# EAGLE design ams (EAGLE 9.5.2)
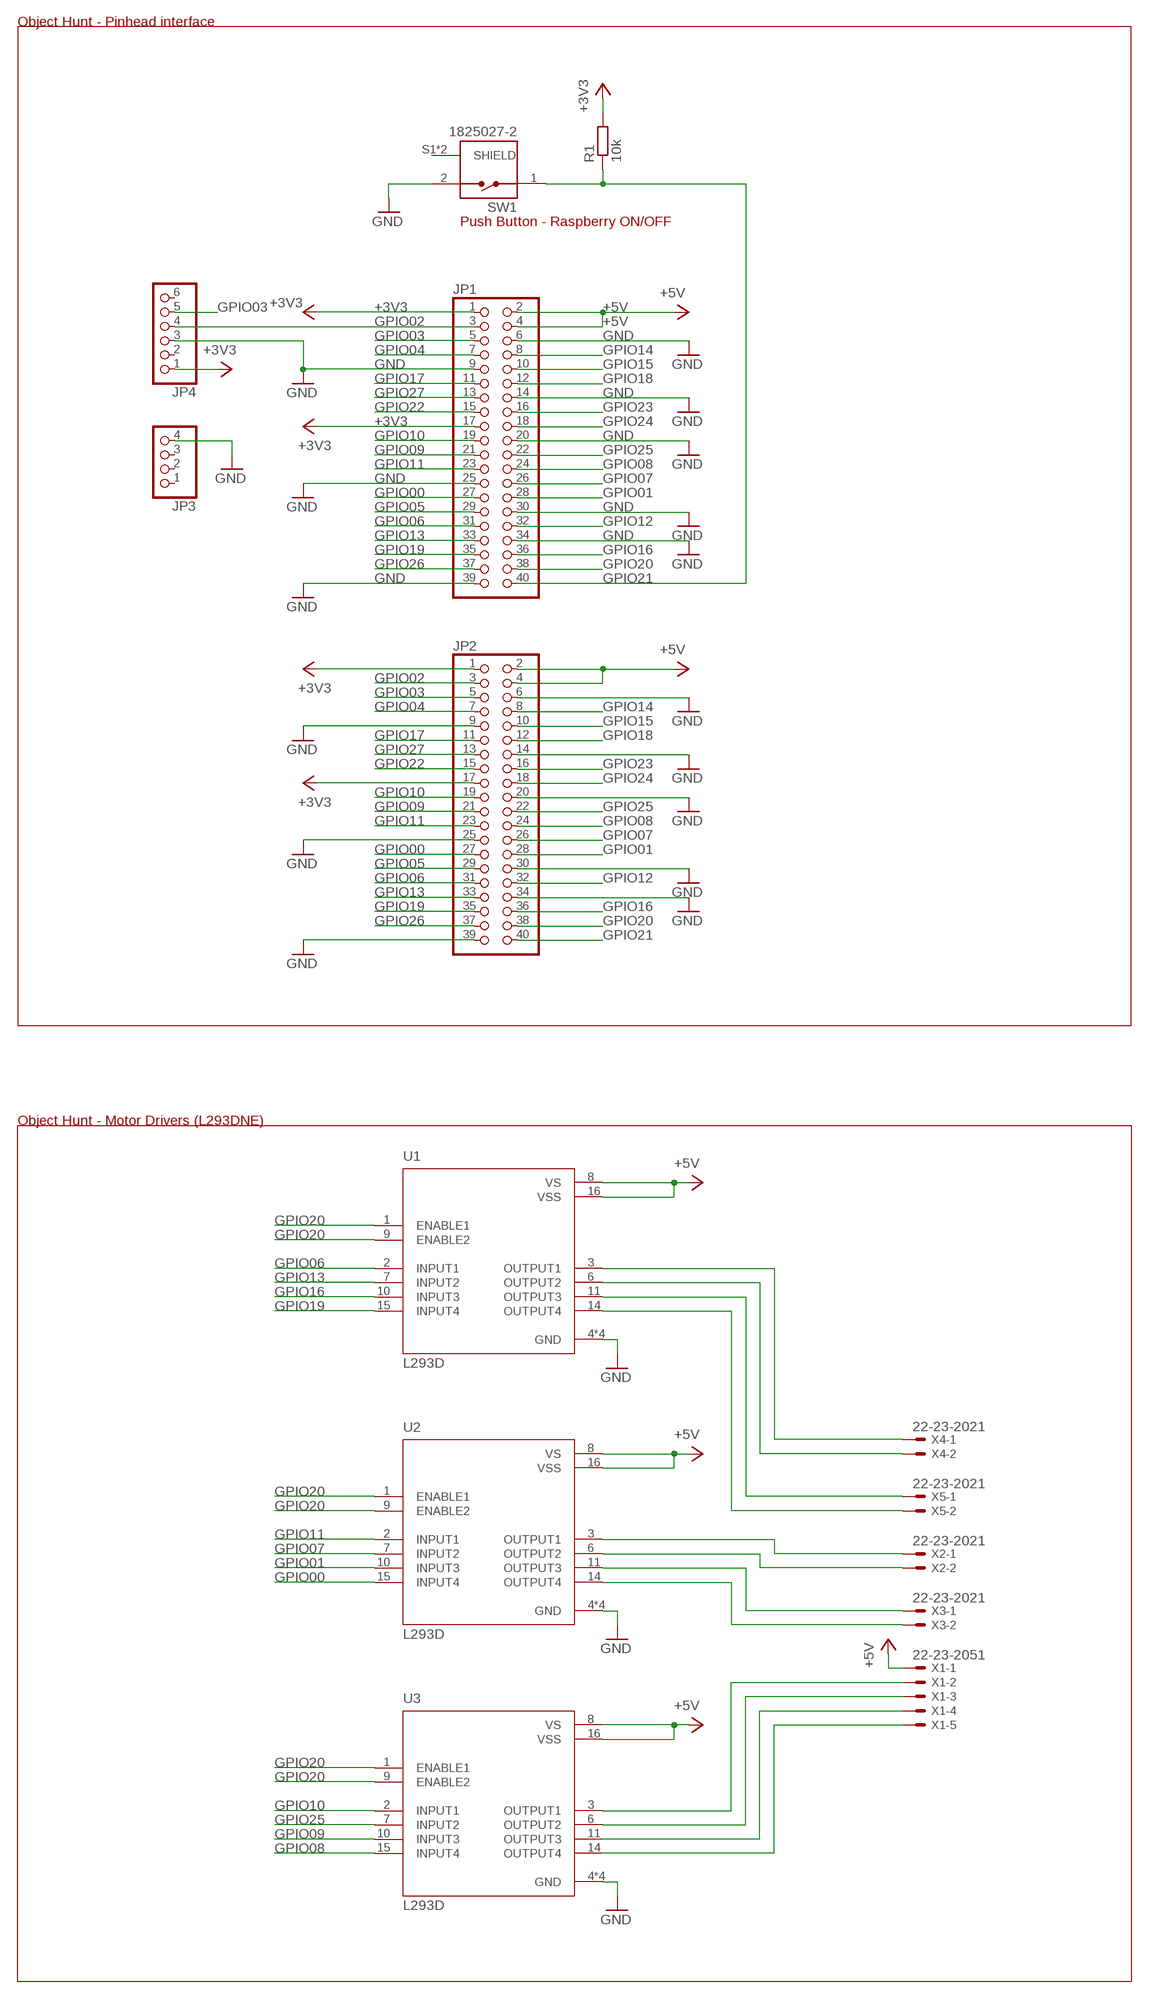
[diagram p0: schematic, sheet 1, part 1 of 2]
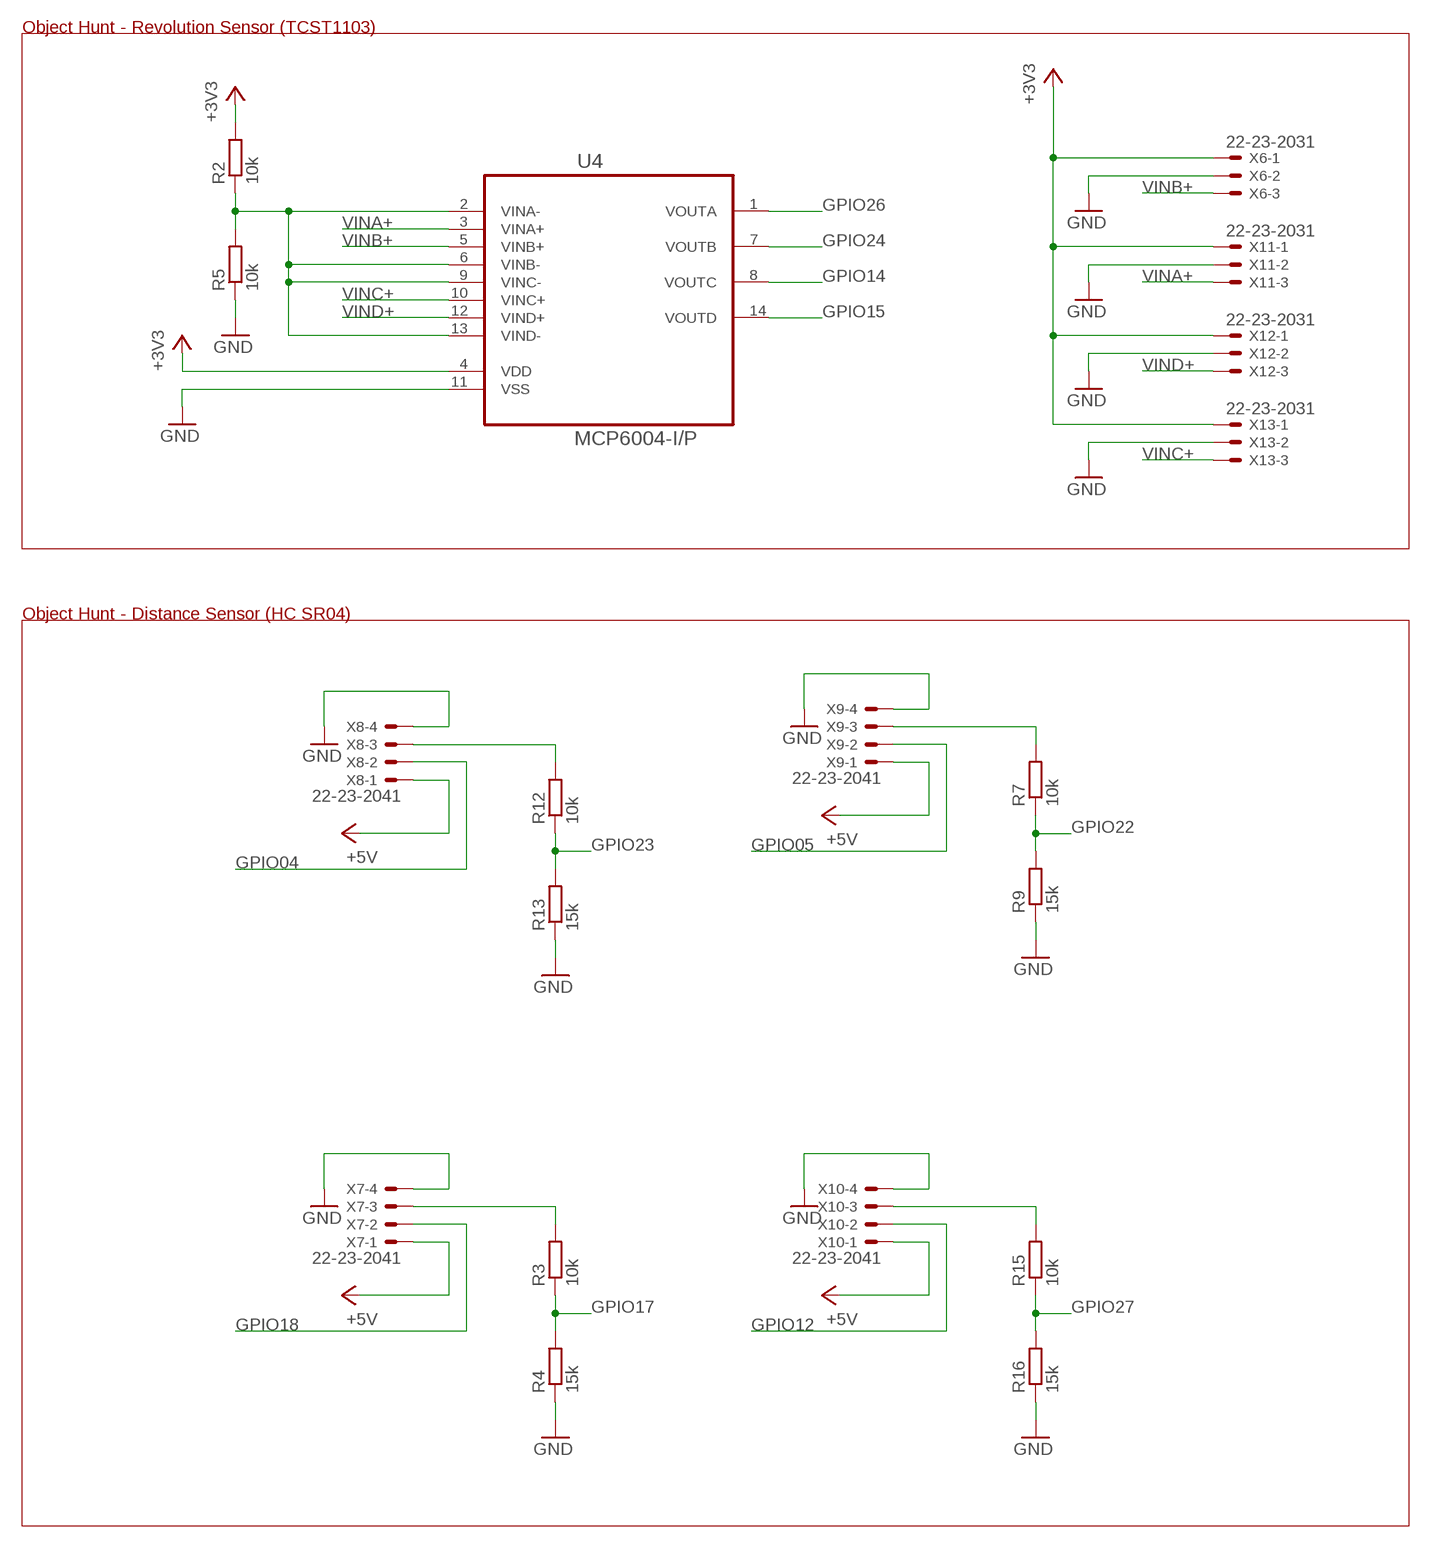
[diagram p1: schematic, sheet 1, part 2 of 2]

## Parts
JP1  PINHD-2X20  [2X20]
JP2  PINHD-2X20  [2X20]
JP3  PINHD-1X4  [1X04]
JP4  PINHD-1X6  [1X06]
R1  10k  R-EU_0204/7  [0204/7]
R2  10k  R-EU_0204/7  [0204/7]
R3  10k  R-EU_0204/7  [0204/7]
R4  15k  R-EU_0204/7  [0204/7]
R5  10k  R-EU_0204/7  [0204/7]
R7  10k  R-EU_0204/7  [0204/7]
R9  15k  R-EU_0204/7  [0204/7]
R12  10k  R-EU_0204/7  [0204/7]
R13  15k  R-EU_0204/7  [0204/7]
R15  10k  R-EU_0204/7  [0204/7]
R16  15k  R-EU_0204/7  [0204/7]
SW1  1825027-2  [TE_1825027-2]
U1  L293D  [DIP880W50P254L2000H510Q16]
U2  L293D  [DIP880W50P254L2000H510Q16]
U3  L293D  [DIP880W50P254L2000H510Q16]
U4  MCP6004-I/P  [DIP254P762X533-14]
X1  22-23-2051  [22-23-2051]
X2  22-23-2021  [22-23-2021]
X3  22-23-2021  [22-23-2021]
X4  22-23-2021  [22-23-2021]
X5  22-23-2021  [22-23-2021]
X6  22-23-2031  [22-23-2031]
X7  22-23-2041  [22-23-2041]
X8  22-23-2041  [22-23-2041]
X9  22-23-2041  [22-23-2041]
X10  22-23-2041  [22-23-2041]
X11  22-23-2031  [22-23-2031]
X12  22-23-2031  [22-23-2031]
X13  22-23-2031  [22-23-2031]

## Nets
+3V3: JP1.1 JP1.17 JP2.1 JP2.17 JP4.1 R1.2 R2.2 U4.4(VDD) X6.1 X11.1 X12.1 X13.1
+5V: JP1.2 JP1.4 JP2.2 JP2.4 U1.8(VS) U1.16(VSS) U2.8(VS) U2.16(VSS) U3.8(VS) U3.16(VSS) X1.1 X7.1 X8.1 X9.1 X10.1
GND: JP1.6 JP1.9 JP1.14 JP1.20 JP1.25 JP1.30 JP1.34 JP1.39 JP2.6 JP2.9 JP2.14 JP2.20 JP2.25 JP2.30 JP2.34 JP2.39 JP3.4 JP4.3 R4.1 R5.1 R9.1 R13.1 R16.1 SW1.2 U1.4(GND) U1.5(GND) U1.12(GND) U1.13(GND) U2.4(GND) U2.5(GND) U2.12(GND) U2.13(GND) U3.4(GND) U3.5(GND) U3.12(GND) U3.13(GND) U4.11(VSS) X6.2 X7.4 X8.4 X9.4 X10.4 X11.2 X12.2 X13.2
GPIO00: JP1.27 JP2.27 U2.15(INPUT4)
GPIO01: JP1.28 JP2.28 U2.10(INPUT3)
GPIO02: JP1.3 JP2.3 JP4.4
GPIO03: JP1.5 JP2.5 JP4.5
GPIO04: JP1.7 JP2.7 X8.2
GPIO05: JP1.29 JP2.29 X9.2
GPIO06: JP1.31 JP2.31 U1.2(INPUT1)
GPIO07: JP1.26 JP2.26 U2.7(INPUT2)
GPIO08: JP1.24 JP2.24 U3.15(INPUT4)
GPIO09: JP1.21 JP2.21 U3.10(INPUT3)
GPIO10: JP1.19 JP2.19 U3.2(INPUT1)
GPIO11: JP1.23 JP2.23 U2.2(INPUT1)
GPIO12: JP1.32 JP2.32 X10.2
GPIO13: JP1.33 JP2.33 U1.7(INPUT2)
GPIO14: JP1.8 JP2.8 U4.8(VOUTC)
GPIO15: JP1.10 JP2.10 U4.14(VOUTD)
GPIO16: JP1.36 JP2.36 U1.10(INPUT3)
GPIO17: JP1.11 JP2.11 R3.1 R4.2
GPIO18: JP1.12 JP2.12 X7.2
GPIO19: JP1.35 JP2.35 U1.15(INPUT4)
GPIO20: JP1.38 JP2.38 U1.1(ENABLE1) U1.9(ENABLE2) U2.1(ENABLE1) U2.9(ENABLE2) U3.1(ENABLE1) U3.9(ENABLE2)
GPIO21: JP1.40 JP2.40 R1.1 SW1.1
GPIO22: JP1.15 JP2.15 R7.1 R9.2
GPIO23: JP1.16 JP2.16 R12.1 R13.2
GPIO24: JP1.18 JP2.18 U4.7(VOUTB)
GPIO25: JP1.22 JP2.22 U3.7(INPUT2)
GPIO26: JP1.37 JP2.37 U4.1(VOUTA)
GPIO27: JP1.13 JP2.13 R15.1 R16.2
N$3: R3.2 X7.3
N$5: R2.1 R5.2 U4.2(VINA-) U4.6(VINB-) U4.9(VINC-) U4.13(VIND-)
N$6: R7.2 X9.3
N$9: R15.2 X10.3
N$25: U1.3(OUTPUT1) X4.1
N$26: U1.6(OUTPUT2) X4.2
N$27: U1.11(OUTPUT3) X5.1
N$28: U1.14(OUTPUT4) X5.2
N$31: U2.3(OUTPUT1) X2.1
N$32: U2.6(OUTPUT2) X2.2
N$33: U2.11(OUTPUT3) X3.1
N$34: U2.14(OUTPUT4) X3.2
N$39: U3.3(OUTPUT1) X1.2
N$40: U3.6(OUTPUT2) X1.3
N$41: U3.11(OUTPUT3) X1.4
N$42: U3.14(OUTPUT4) X1.5
N$47: R12.2 X8.3
VINA+: U4.3(VINA+) X11.3
VINB+: U4.5(VINB+) X6.3
VINC+: U4.10(VINC+) X13.3
VIND+: U4.12(VIND+) X12.3
Unconnected: JP3.1 JP3.2 JP3.3 JP4.2 JP4.6 SW1.S1(SHIELD) SW1.S2(SHIELD)

## Notes on the sheet
- Object Hunt - Pinhead interface
- Push Button - Raspberry ON/OFF
- Object Hunt - Motor Drivers (L293DNE)
- Object Hunt - Revolution Sensor (TCST1103)
- Object Hunt - Distance Sensor (HC SR04)

## Library data of the parts
JP1 JP2 = pinhead:PINHD-2X20: PIN HEADER
JP3 = pinhead:PINHD-1X4: PIN HEADER
JP4 = pinhead:PINHD-1X6: PIN HEADER
R1-R5 R7 R9 R12 R13 R15 R16 = rcl:R-EU_: RESISTOR, European symbol; SPICEPREFIX: R
SW1 = 1825027-2:1825027-2: Switch Tactile OFF (ON) SPST Round Button PC Pins 0.05A 24VDC 1.57N Thru-Hole Loose Piece; AVAILABILITY: Unavailable; COMMENT: 1825027-2; DESCRIPTION: Switch Tactile OFF _ON_ SPST Round Button PC Pins 0.05A 24VDC 1.57N Thru-Hole Loose Piece; EU_ROHS_COMPLIANCE: Compliant; MF: TE Connectivity; MP: 1825027-2; PACKAGE: None; PRICE: None; TE_PURCHASE_URL: https://www.te.com/usa-en/product-1825027-2.html?te_bu=Cor&te_type=disp&te_campaign=seda_glo_cor-seda-global-disp-prtnr-fy19-seda-model-bom-cta_sma-317_1&elqCampaignId=32493
U1-U3 = L293D:L293D: 4-Channel Motor Driver 24V 16-Pin Power PDIP Tube; AVAILABILITY: Unavailable; DESCRIPTION: 4-Channel Motor Driver 24V 16-Pin Power PDIP Tube; MF: STMicroelectronics; MP: L293D; PACKAGE: DIP-16 STMicroelectronics; PRICE: None
U4 = Microchip_By_element14_Batch_1:MCP6004-I/P: IC OPAMP QUAD 1.8V; MPN: MCP6004-I/P; OC_FARNELL: 1605571; OC_NEWARK: 61K2951; PACKAGE: 14DIP; SUPPLIER: Microchip
X1 = con-molex:22-23-2051: .100" (2.54mm) Center Header - 5 Pin; MF: MOLEX; MPN: 22-23-2051; OC_FARNELL: 1462952; OC_NEWARK: 38C9178
X2-X5 = con-molex:22-23-2021: .100" (2.54mm) Center Header - 2 Pin; MF: MOLEX; MPN: 22-23-2021; OC_FARNELL: 1462926; OC_NEWARK: 25C3832
X6 X11-X13 = con-molex:22-23-2031: .100" (2.54mm) Center Header - 3 Pin; MF: MOLEX; MPN: 22-23-2031; OC_FARNELL: 1462950; OC_NEWARK: 30C0862
X7-X10 = con-molex:22-23-2041: .100" (2.54mm) Center Header - 4 Pin; MF: MOLEX; MPN: 22-23-2041; OC_FARNELL: 1462920; OC_NEWARK: 38C0355

## Board
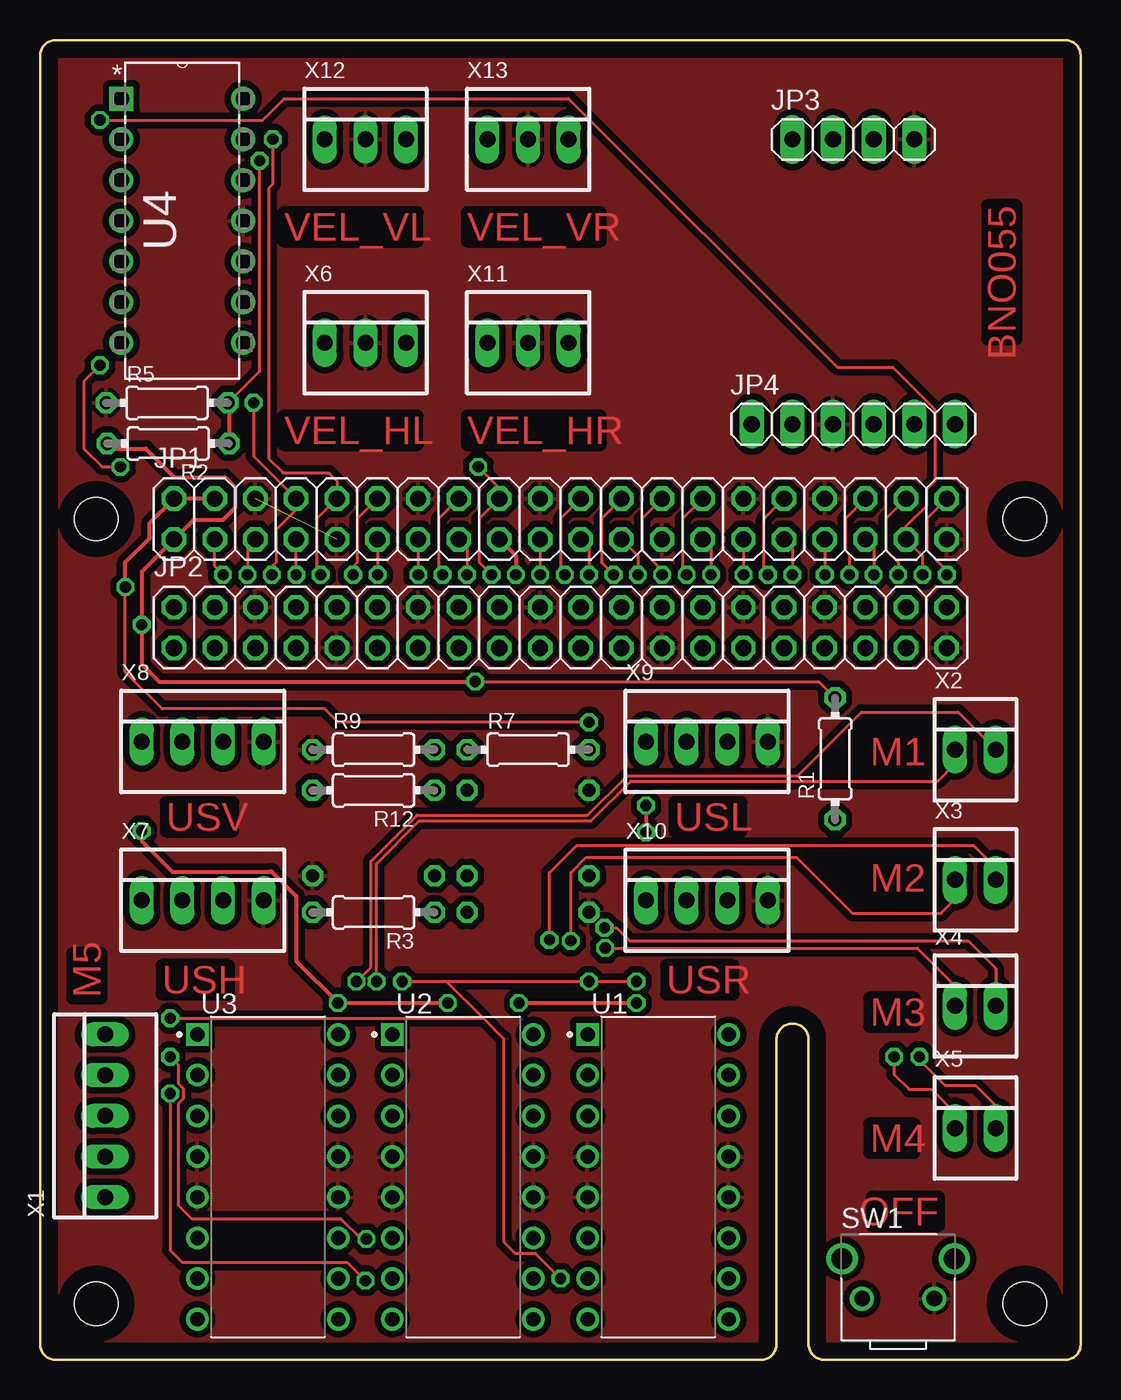
[diagram p2: board, top side]
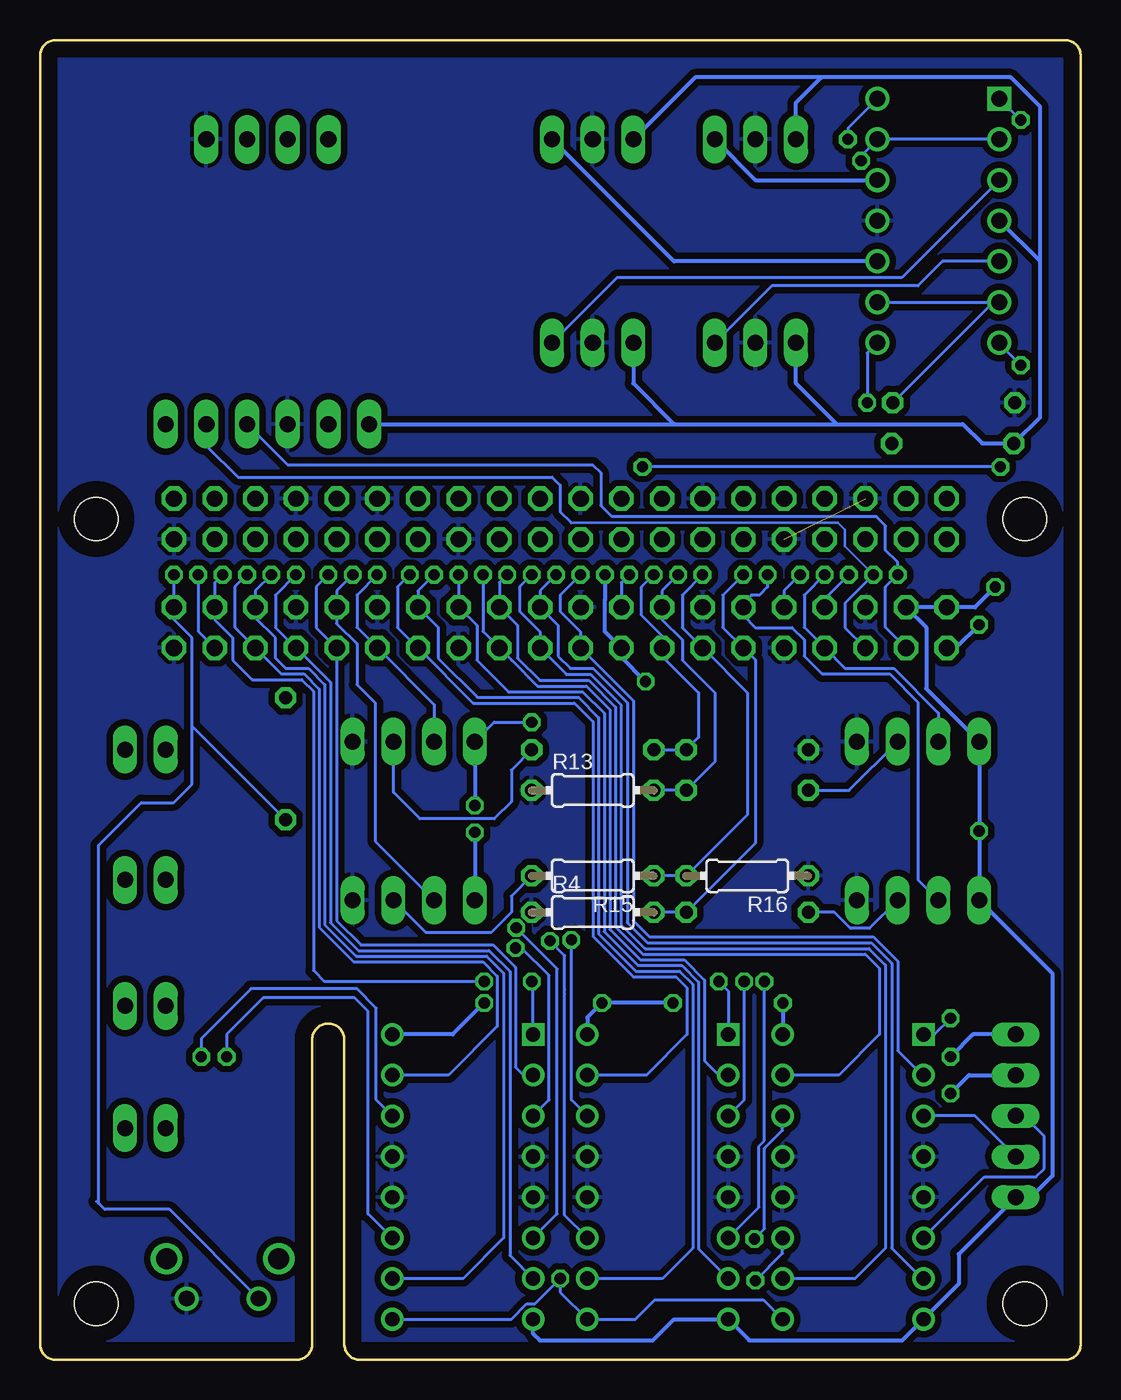
[diagram p3: board, bottom side, seen from below]

Size 65 x 82.4 mm. Coordinates in mm from the lower left corner, seen from the top.
Outline: 1,0 45,0 arc90 46,1 46,20 arc-90 47,21 arc-90 48,20 48,1 arc90 49,0 64,0 arc90 65,1 65,81.4 arc90 64,82.4 1,82.4 arc90 0,81.4 0,1 arc90 1,0
Copper layers (1*16): Top 0.035mm / dielectric 1.5mm / Bottom 0.035mm
Design rules "default": minimum track width 6mil, minimum drill 0.35mm, track to track 6mil, track to pad 6mil, pad to pad 6mil, via to via 6mil, smd to smd 6mil, copper to edge 40mil, drill to drill 6mil, minimum pad ring 10mil, minimum via ring 8mil, stop-mask expansion 4mil, vias tented up to drill 0mil, thermal gap 10mil
Holes 2.7 mm at 3.5,52.5 61.5,52.5 3.5,3.5 61.5,3.5

### Footprints (pad centres in the part's own frame; a part is rotated, then mirrored left to right if it is on the bottom)
2X20 = drill 1.016 octagon: 1 -24.13,-1.27; 2 -24.13,1.27; 3 -21.59,-1.27; 4 -21.59,1.27; 5 -19.05,-1.27; 6 -19.05,1.27; 7 -16.51,-1.27; 8 -16.51,1.27; 9 -13.97,-1.27; 10 -13.97,1.27; 11 -11.43,-1.27; 12 -11.43,1.27; 13 -8.89,-1.27; 14 -8.89,1.27; 15 -6.35,-1.27; 16 -6.35,1.27; 17 -3.81,-1.27; 18 -3.81,1.27; 19 -1.27,-1.27; 20 -1.27,1.27; 21 1.27,-1.27; 22 1.27,1.27; 23 3.81,-1.27; 24 3.81,1.27; 25 6.35,-1.27; 26 6.35,1.27; 27 8.89,-1.27; 28 8.89,1.27; 29 11.43,-1.27; 30 11.43,1.27; 31 13.97,-1.27; 32 13.97,1.27; 33 16.51,-1.27; 34 16.51,1.27; 35 19.05,-1.27; 36 19.05,1.27; 37 21.59,-1.27; 38 21.59,1.27; 39 24.13,-1.27; 40 24.13,1.27
1X04 = drill 1.016 long: 1 -3.81,0; 2 -1.27,0; 3 1.27,0; 4 3.81,0
1X06 = drill 1.016 long: 1 -6.35,0; 2 -3.81,0; 3 -1.27,0; 4 1.27,0; 5 3.81,0; 6 6.35,0
0204/7 = drill 0.813 octagon: 1 -3.81,0; 2 3.81,0
TE_1825027-2 = drill 0.99: 1 -2.25,-1.245; 2 2.25,-1.245 | drill 1.3: S1 -3.505,1.245; S2 3.505,1.245
DIP880W50P254L2000H510Q16 = drill 0.9 pad 1.25 square: 1 -4.4,8.89 | drill 0.9 pad 1.25: 2 -4.4,6.35; 3 -4.4,3.81; 4 -4.4,1.27; 5 -4.4,-1.27; 6 -4.4,-3.81; 7 -4.4,-6.35; 8 -4.4,-8.89; 9 4.4,-8.89; 10 4.4,-6.35; 11 4.4,-3.81; 12 4.4,-1.27; 13 4.4,1.27; 14 4.4,3.81; 15 4.4,6.35; 16 4.4,8.89
DIP254P762X533-14 = drill 0.991 square: 1 -7.62,15.24 | drill 0.991: 2 -7.62,12.7; 3 -7.62,10.16; 4 -7.62,7.62; 5 -7.62,5.08; 6 -7.62,2.54; 7 -7.62,0; 8 0,0; 9 0,2.54; 10 0,5.08; 11 0,7.62; 12 0,10.16; 13 0,12.7; 14 0,15.24
22-23-2051 = drill 1 long: 1 -5.08,0; 2 -2.54,0; 3 0,0; 4 2.54,0; 5 5.08,0
22-23-2021 = drill 1 long: 1 -1.27,0; 2 1.27,0
22-23-2031 = drill 1 long: 1 -2.54,0; 2 0,0; 3 2.54,0
22-23-2041 = drill 1 long: 1 -3.81,0; 2 -1.27,0; 3 1.27,0; 4 3.81,0

### Placement (x,y rotation side)
JP1  32.5,52.5 0 top
JP2  32.5,45.72 0 top
JP3  50.8,76.2 0 top
JP4  50.8,58.42 0 top
R1  49.66,37.53 90 top
R2  8,57.21 180 top
R3  20.83,27.94 180 top
R4  30.48,27.94 0 bottom
R5  7.94,59.75 0 top
R7  30.48,38.1 0 top
R9  20.83,38.1 0 top
R12  20.83,35.56 180 top
R13  30.48,35.56 0 bottom
R15  30.48,30.23 180 bottom
R16  20.83,30.23 180 bottom
SW1  53.59,5.08 0 top
U1  38.61,11.43 0 top
U2  26.42,11.43 0 top
U3  14.22,11.43 0 top
U4  12.7,63.5 0 top
X1  4.06,15.24 90 top
X2  58.42,38.1 0 top
X3  58.42,29.97 0 top
X4  58.42,22.1 0 top
X5  58.42,14.48 0 top
X6  20.32,63.5 0 top
X7  10.16,28.7 0 top
X8  10.16,38.61 0 top
X9  41.66,38.61 0 top
X10  41.66,28.7 0 top
X11  30.48,63.5 0 top
X12  20.32,76.2 0 top
X13  30.48,76.2 0 top

### Tracks (layer width: path | path; a pad name or v marks a point on that pad's centre or on a via)
+3V3  (via drill 0.7)
  Top 0.2: v27.18,42.35 48.64,42.35 R1.2
  Top 0.254: JP1.17 29.72,50.2 v29.72,49.02 | v27.18,42.35 7.43,42.35 6.35,43.43 v6.35,45.9 6.35,49.21 JP1.1 9.59,52.45 11.43,52.45 12.19,53.21 12.19,54.48 11.56,55.12 8.38,55.12 6.6,56.9 4.51,56.9 R2.2
  Bottom 0.254: v6.35,45.9 7.8,44.45 JP2.1 | v29.72,49.02 29.72,47.44 29.73,47.42 29.73,45.49 JP2.17 28.69,43.87 v27.18,42.35 | 2.54,68.58 U4.4 | 15.24,58.42 17.78,60.96 X6.1 | X11.1 27.94,60.96 25.4,58.42 | 25.4,58.42 15.24,58.42 | X13.1 24.07,80.07 16.19,80.07 | X12.1 17.78,78.49 16.19,80.07 | 2.54,68.58 2.54,58.86 R2.2 6.16,57.21 7.37,58.42 15.24,58.42 | 2.54,68.58 2.54,78.23 4.38,80.07 16.19,80.07 | JP4.1 25.4,58.42
+5V  (via drill 0.7)
  Top 0.2: v34.29,39.81 18.61,39.81 17.78,40.64 7.62,40.64 5.33,42.93 v5.33,48.26
  Top 0.254: JP1.4 JP1.2 6.86,52.26 6.86,51.31 5.33,49.78 v5.33,48.26 | v6.35,33.02 6.35,32.38 8.25,30.49 14.4,30.49 14.41,30.48 14.48,30.48 16,28.96 16,24.89 v18.61,22.29 v25.46,22.29 | v29.91,22.29 v37.26,22.29 | v37.85,34.61 v37.85,32.94
  Bottom 0.2: X9.1 36.64,39.81 v34.29,39.81
  Bottom 0.254: v5.33,48.26 6.6,46.99 JP2.2 JP2.4 9.65,45.73 9.65,41.91 X8.1 v6.35,33.02 X7.1 1.78,24.13 1.78,11.49 3.11,10.16 X1.1 7.62,6.6 7.62,4.74 U3.8 11.14,1.22 20.7,1.22 U2.8 25.4,2.54 26.72,1.22 33.78,1.22 34.21,1.65 U1.8 | U2.16 30.82,21.38 v29.91,22.29 v25.46,22.29 | v18.61,22.29 18.61,20.34 U3.16 | v37.26,22.29 39.22,20.32 U1.16 | X9.1 v37.85,34.61 | v37.85,32.94 X10.1
GND  (1 unrouted)
  pour Bottom (isolate 0.406): 0,81.42 0,1 arc90 1,0 45,0 arc90 46,1 46,20 arc-90 47,21 arc-90 48,20 48,1 arc90 49,0 64,0 arc90 65,1 65,81.42 arc90 64.02,82.4 0.98,82.4 arc90
  pour Top (isolate 0.406): 0,81.42 0,1 arc90 1,0 45,0 arc90 46,1 46,20 arc-90 47,21 arc-90 48,20 48,1 arc90 49,0 64,0 arc90 65,1 65,81.42 arc90 64.02,82.4 0.98,82.4 arc90
GPIO00  (via drill 0.7)
  Top 0.2: JP1.27 41.91,50.71 v41.91,49.02
  Bottom 0.2: 41.91,44.97 41.9,44.96 | 41.9,44.96 JP2.27 37.95,41.01 31.62,41.01 30.46,39.85 30.46,26.45 27.94,23.92 25.27,23.92 24.58,23.23 24.58,20.32 27.12,17.78 U2.15 | v41.91,49.02 42.67,48.26 42.67,45.72 41.92,44.96 41.9,44.96
GPIO01  (via drill 0.7)
  Top 0.2: JP1.28 40.13,52.51 40.13,49.28 v40.39,49.02
  Bottom 0.2: U2.10 26.13,5.08 24.23,6.99 24.23,23.44 25.06,24.27 27.79,24.27 30.11,26.59 30.11,40.1 31.37,41.36 37.68,41.36 40.13,43.81 40.13,45.73 JP2.28 41.39,48.02 v40.39,49.02
GPIO02  (via drill 0.7)
  Top 0.2: v11.43,49.02 10.91,49.54 JP1.3
  Bottom 0.2: JP4.4 49.53,55.88 30.48,55.88 29.97,55.37 29.97,53.34 29.27,52.64 12.76,52.64 12.19,52.07 12.19,50.55 11.43,49.78 v11.43,49.02 12.19,48.26 12.19,45.73 JP2.3
GPIO03  (via drill 0.7)
  Top 0.2: JP1.5 12.95,50.73 v12.95,49.02
  Bottom 0.152: v12.95,49.02 14.73,50.8 14.73,51.31 14.73,51.82 15.18,52.26 31.81,52.26
  Bottom 0.2: JP4.5 54.61,57.09 52.64,55.12 33.02,55.12 32.51,54.61 32.51,52.96 31.81,52.26 | v12.95,49.02 14.73,47.24 14.73,45.72 13.46,44.45 JP2.5
GPIO04  (via drill 0.7)
  Top 0.2: v16,49.02 16,51.22 JP1.7
  Bottom 0.2: X8.2 8.89,40.39 11.68,43.18 14.72,43.18 JP2.7 17.27,45.73 17.27,47.75 v16,49.02
GPIO05  (via drill 0.7)
  Top 0.2: JP1.29 43.94,51.22 v43.94,49.02
  Bottom 0.2: X9.2 40.39,40.91 JP2.29 45.21,45.73 45.21,47.75 v43.94,49.02
GPIO06  (via drill 0.7)
  Top 0.2: JP1.31 46.99,50.71 v46.99,49.02
  Bottom 0.2: U1.2 34.8,17.78 35.31,18.29 35.31,24.51 36.7,25.91 44.96,25.91 46.47,27.42 46.47,39.78 JP2.31 46.99,44.97 47,44.97 47.75,45.72 47.75,48.26 v46.99,49.02
GPIO07  (via drill 0.7)
  Top 0.2: JP1.26 37.59,52.51 37.59,50.55 38.86,49.28 v38.86,49.02
  Bottom 0.2: U2.7 23.88,6.94 23.88,23.59 24.91,24.62 27.64,24.62 29.76,26.74 29.76,40.36 31.11,41.71 35.74,41.71 37.72,43.69 37.72,45.86 JP2.26 v38.85,49.01 v38.86,49.02
GPIO08  (via drill 0.7)
  Top 0.2: JP1.24 35.05,52.51 35.05,49.78 v35.81,49.02
  Bottom 0.2: U3.15 15.11,17.78 12.57,20.32 12.57,24.44 13.46,25.33 27.35,25.33 29.05,27.03 29.05,40.75 30.72,42.42 33.78,42.42 35.18,43.81 35.18,45.86 JP2.24 36.31,48.53 v35.81,49.02
GPIO09  (via drill 0.7)
  Top 0.2: JP1.21 34.29,50.71 v34.29,49.02
  Bottom 0.2: U3.10 14.1,5.08 12.19,6.99 12.19,24.65 13.23,25.68 27.21,25.68 28.7,27.18 28.7,40.89 30.61,42.8 32.12,42.8 JP2.21 33.77,45.45 35.05,46.74 35.05,48.26 v34.29,49.02
GPIO10  (via drill 0.7)
  Top 0.2: JP1.19 31.24,51.22 v31.24,49.02
  Bottom 0.2: U3.2 9.91,17.78 11.43,19.3 11.43,24.89 12.95,26.42 26.92,26.42 27.94,27.43 27.94,41.16 JP2.19 31.23,45.45 32.51,46.74 32.51,47.75 v31.24,49.02
GPIO11  (via drill 0.7)
  Top 0.2: JP1.23 37.34,50.2 v37.34,49.02
  Bottom 0.2: v37.34,49.02 37.34,45.48 JP2.23 35.53,43.67 33.93,42.07 30.87,42.07 29.41,40.6 29.41,26.89 27.5,24.98 24.77,24.98 23.5,23.71 23.5,18.67 22.61,17.78 U2.2
GPIO12  (via drill 0.7)
  Top 0.2: JP1.32 45.21,52.51 45.21,49.28 v45.47,49.02
  Bottom 0.2: X10.2 44.07,32.38 44.07,41.02 45.21,42.16 45.21,44.7 46.48,45.97 46.48,46.98 JP2.32 46.47,48.02 v45.47,49.02
GPIO13  (via drill 0.7)
  Top 0.2: JP1.33 49.02,51.22 v49.02,49.02
  Bottom 0.2: U1.7 35.66,6.53 35.66,24.26 36.96,25.56 45.11,25.56 46.86,27.3 46.86,42.3 JP2.33 49.02,44.46 49.03,44.46 50.29,45.72 50.29,47.75 v49.02,49.02
GPIO14  (via drill 0.7)
  Top 0.2: v13.34,59.75 13.34,56.42 JP1.8 15.99,53.07 14.73,51.82 14.73,49.78 14.48,49.53 v14.48,49.02
  Bottom 0.2: U4.8 13.34,62.87 v13.34,59.75 | v14.48,49.02 15.99,47.51 JP2.8
GPIO15  (via drill 0.7)
  Top 0.2: v14.54,76.2 14.54,73.41 14.29,73.15 14.29,56.26 15.18,55.37 18.03,55.37 18.54,54.86 18.54,53.78 JP1.10 17.27,52.51 17.27,49.28 v17.53,49.02
  Bottom 0.2: U4.14 14.54,76.9 v14.54,76.2 | v17.53,49.02 18.53,48.02 JP2.10
GPIO16  (via drill 0.7)
  Top 0.2: JP1.36 50.29,52.51 50.29,50.55 50.55,50.29 v50.55,49.02
  Bottom 0.2: U1.10 38.58,5.08 36.04,7.62 36.04,24.14 37.1,25.2 45.26,25.2 47.22,27.16 47.22,42.16 48.24,43.18 49.66,43.18 50.29,43.81 50.29,45.09 51.55,46.34 JP2.36 51.55,48.02 v50.55,49.02
GPIO17  (via drill 0.7)
  Top 0.2: JP1.11 21.08,51.22 v21.08,49.02
  Bottom 0.2: R4.2 R3.1 20.32,32.26 20.32,43.7 JP2.11 22.34,45.72 22.35,45.72 22.35,47.75 v21.08,49.02
GPIO18  (via drill 0.7)
  Top 0.2: JP1.12 19.81,52.51 19.81,49.78 19.56,49.53 v19.56,49.02
  Bottom 0.2: X7.2 10.16,29.97 10.16,41.05 11.94,42.83 16.16,42.83 17.27,43.94 17.27,44.96 18.03,45.72 20.32,45.72 21.08,46.48 21.08,46.98 JP2.12 | 21.07,47 JP2.12 | v19.56,49.02 19.56,48.26 20.07,47.75 20.57,47.75 21.07,47.26 JP2.12
GPIO19  (via drill 0.7)
  Top 0.2: JP1.35 52.07,50.71 v52.07,49.02
  Bottom 0.2: U1.15 39.5,17.78 36.45,20.83 36.45,23.96 37.34,24.85 45.41,24.85 47.57,27.01 47.57,41.88 48.51,42.83 49.93,42.83 JP2.35 52.83,45.73 52.83,48.26 v52.07,49.02
GPIO20  (via drill 0.7)
  Top 0.2: JP1.38 52.83,52.51 52.83,50.55 53.59,49.78 v53.59,49.02 | v37.26,23.62 v34.29,23.62 25.4,23.62 | 25.4,23.62 v22.61,23.62 | 27.69,21.34 25.4,23.62 | v32.51,5.08 30.93,6.66 29.66,6.66 28.96,7.37 28.96,20.07 27.69,21.34 | v8.13,21.34 27.69,21.34
  Bottom 0.2: v37.26,23.62 47.22,23.62 47.92,24.33 47.92,41.73 48.66,42.48 51.75,42.48 52.96,43.69 52.96,45.09 54.09,46.22 JP2.38 54.09,48.53 v53.59,49.02 | v22.61,23.62 22.02,23.03 U2.1 | U1.1 34.21,23.54 v34.29,23.62 | U1.9 35.56,2.54 34.6,3.5 34.1,3.5 v32.51,5.08 32.51,4.24 U2.9 27.81,2.54 26.61,3.75 19.83,3.75 U3.9 | U3.1 9.14,20.32 v8.13,21.34
GPIO21  (via drill 0.7)
  Top 0.2: JP1.40 55.37,52.51 55.37,50.55 56.64,49.28 v56.64,49.02
  Bottom 0.2: SW1.1 56.91,9.4 60.96,9.4 61.34,9.78 | 61.34,9.78 61.47,9.91 | R1.1 55.5,39.56 | 55.5,39.56 55.5,45.09 56.63,46.22 JP2.40 56.64,47 v56.64,49.02 | 61.34,9.78 61.34,32.13 58.67,34.8 56.64,34.8 55.5,35.94 55.5,39.56
GPIO22  (via drill 0.7)
  Top 0.2: JP1.15 26.67,50.71 v26.67,49.02
  Bottom 0.2: R7.1 R9.2 23.88,38.86 23.88,41.66 26.15,43.93 JP2.15 26.15,45.2 27.43,46.48 27.43,48.26 v26.67,49.02
GPIO23  (via drill 0.7)
  Top 0.2: JP1.16 24.89,52.51 24.89,49.28 v25.15,49.02
  Bottom 0.2: R13.2 R12.1 22.86,37.34 22.86,41.66 24.89,43.69 24.89,44.96 26.15,46.22 JP2.16 26.15,48.02 v25.15,49.02
GPIO24  (via drill 0.7)
  Top 0.2: v3.75,62.1 2.73,61.09 2.73,56.9 3.87,55.75 v5.02,55.75 | v27.37,55.75 28.69,54.43 JP1.18 27.43,52.51 27.43,49.78 v28.19,49.02
  Bottom 0.2: v28.19,49.02 28.69,48.53 JP2.18 | U4.7 5.08,63.44 v3.75,62.1 | v5.02,55.75 v27.37,55.75
GPIO25  (via drill 0.7)
  Top 0.2: JP1.22 32.51,52.51 32.51,49.28 v32.77,49.02
  Bottom 0.2: U3.7 9.91,5.08 11.81,6.99 11.81,24.77 13.08,26.04 27.05,26.04 28.32,27.3 28.32,41.04 30.46,43.18 31.88,43.18 32.64,43.94 32.64,45.86 JP2.22 33.77,48.02 v32.77,49.02
GPIO26  (via drill 0.7)
  Top 0.2: v55.12,49.02 55.12,50.2 JP1.37 54.09,52.06 55.37,53.34 55.37,54.36 55.88,54.86 55.88,59.35 53.25,61.98 49.78,61.98 33.02,78.74 15.24,78.74 13.91,77.41 v3.75,77.41
  Bottom 0.2: v55.12,49.02 55.12,45.48 JP2.37 | U4.1 v3.75,77.41
GPIO27  (via drill 0.7)
  Top 0.2: JP1.13 23.62,51.22 v23.62,49.02
  Bottom 0.2: R15.1 R16.2 20.83,34.04 20.83,41.67 JP2.13 23.62,44.46 23.63,44.46 24.89,45.72 24.89,47.75 v23.62,49.02
N$3
  Bottom 0.2: R3.2 15.38,27.94 14.39,26.94 13.19,26.94 X7.3
N$5  (via drill 0.7)
  Top 0.2: R5.2 13.72,61.72 v13.72,74.87
  Top 0.254: R2.1 11.81,59.69 R5.2
  Bottom 0.2: U4.9 U4.6 5.46,66.04 R5.2 | U4.2 U4.13 13.72,75.18 v13.72,74.87
N$6
  Bottom 0.2: R7.2 35.56,36.83 35.56,34.86 36.64,33.78 41.27,33.78 42.93,35.43 X9.3
N$9
  Bottom 0.2: R15.2 35.56,28.96 35.56,27.94 36.83,26.67 40.89,26.67 X10.3
N$25  (via drill 0.7)
  Top 0.2: v35.31,25.72 54.8,25.72 57.15,23.37 X4.1
  Bottom 0.2: U1.3 33.21,16.24 33.21,24 34.92,25.72 v35.31,25.72
N$26  (via drill 0.7)
  Top 0.2: v35.26,26.98 36.02,26.98 36.83,26.16 57.98,26.16 59.69,24.45 X4.2
  Bottom 0.2: U1.6 32.7,9.13 32.7,24.42 v35.26,26.98
N$27  (via drill 0.7)
  Top 0.2: v53.34,18.92 53.34,17.84 54.29,16.89 55.69,16.89 57.15,15.43 X5.1
  Bottom 0.2: U1.11 44.51,9.13 44.51,21.78 45.34,22.61 51.05,22.61 53.34,20.32 v53.34,18.92
N$28  (via drill 0.7)
  Top 0.2: v54.93,18.92 54.93,18.73 56.52,17.14 58.42,17.14 59.69,15.88 X5.2
  Bottom 0.2: U1.14 44.01,16.24 44.01,21.97 45.21,23.18 51.82,23.18 54.93,20.07 v54.93,18.92
N$31  (via drill 0.7)
  Top 0.2: v21.02,23.62 21.02,30.99 23.69,33.66 34.42,33.66 36.89,36.13 56.07,36.13 57.15,37.21 X2.1
  Bottom 0.2: U2.3 21.02,16.24 v21.02,23.62
N$32  (via drill 0.7)
  Top 0.2: v19.76,23.62 20.67,24.53 20.67,31.13 23.54,34.01 34.21,34.01 36.68,36.48 47.34,36.48 51.31,40.45 57.34,40.45 X2.2
  Bottom 0.2: U2.6 20.1,9.54 20.1,13.35 19.76,13.7 v19.76,23.62
N$33  (via drill 0.7)
  Top 0.2: v33.15,26.16 33.15,30.42 34.1,31.37 47.24,31.37 50.74,27.88 56.26,27.88 57.15,28.77 X3.1
  Bottom 0.2: U2.11 32.23,9.03 32.23,22.86 32.23,23.11 32.23,25.24 v33.15,26.16
N$34  (via drill 0.7)
  Top 0.2: v31.81,26.23 31.81,30.42 33.53,32.13 58.29,32.13 59.69,30.73 X3.2
  Bottom 0.2: U2.14 31.81,16.24 v31.81,26.23
N$39
  Bottom 0.2: X1.2 6.6,15.24 U3.3
N$40
  Bottom 0.2: U3.6 6.01,11.43 2.79,11.43 2.29,11.94 2.29,13.97 3.56,15.24 X1.3
N$41  (via drill 0.7)
  Top 0.2: v20.32,4.95 19.18,6.1 8.89,6.1 8.13,6.86 v8.13,16.64
  Bottom 0.2: v20.32,4.95 18.62,6.65 U3.11
  Bottom 0.254: v8.13,16.64 6.99,17.78 X1.4
N$42  (via drill 0.7)
  Top 0.2: v20.38,7.56 20.04,7.56 18.77,8.83 9.46,8.83 8.64,9.65 8.64,16.01 8.93,16.3 8.93,16.97 8.64,17.27 8.64,18.41 v8.13,18.92
  Bottom 0.2: v20.38,7.56 19.75,8.19 19.75,13.21 18.62,14.33 U3.14
  Bottom 0.254: X1.5 6.73,20.32 v8.13,18.92
N$47
  Bottom 0.2: R12.2 14.48,35.56 X8.3
VINA+
  Bottom 0.2: X11.3 28.96,67.56 11.18,67.56 U4.3
VINB+
  Bottom 0.2: X6.3 19.3,67.06 10.16,67.06 8.64,68.58 U4.5
VINC+
  Bottom 0.254: U4.10 25.4,68.58 X13.3
VIND+
  Bottom 0.254: X12.3 20.32,73.66 U4.12

### Text on the board
Top: BNO055 | VEL_VL | VEL_VR | VEL_HL | VEL_HR | M1 | USV | USL | M2 | M5 | USH | USR | M3 | M4 | OFF